# EAGLE design midi-in-out-mini (EAGLE 7.7.0)
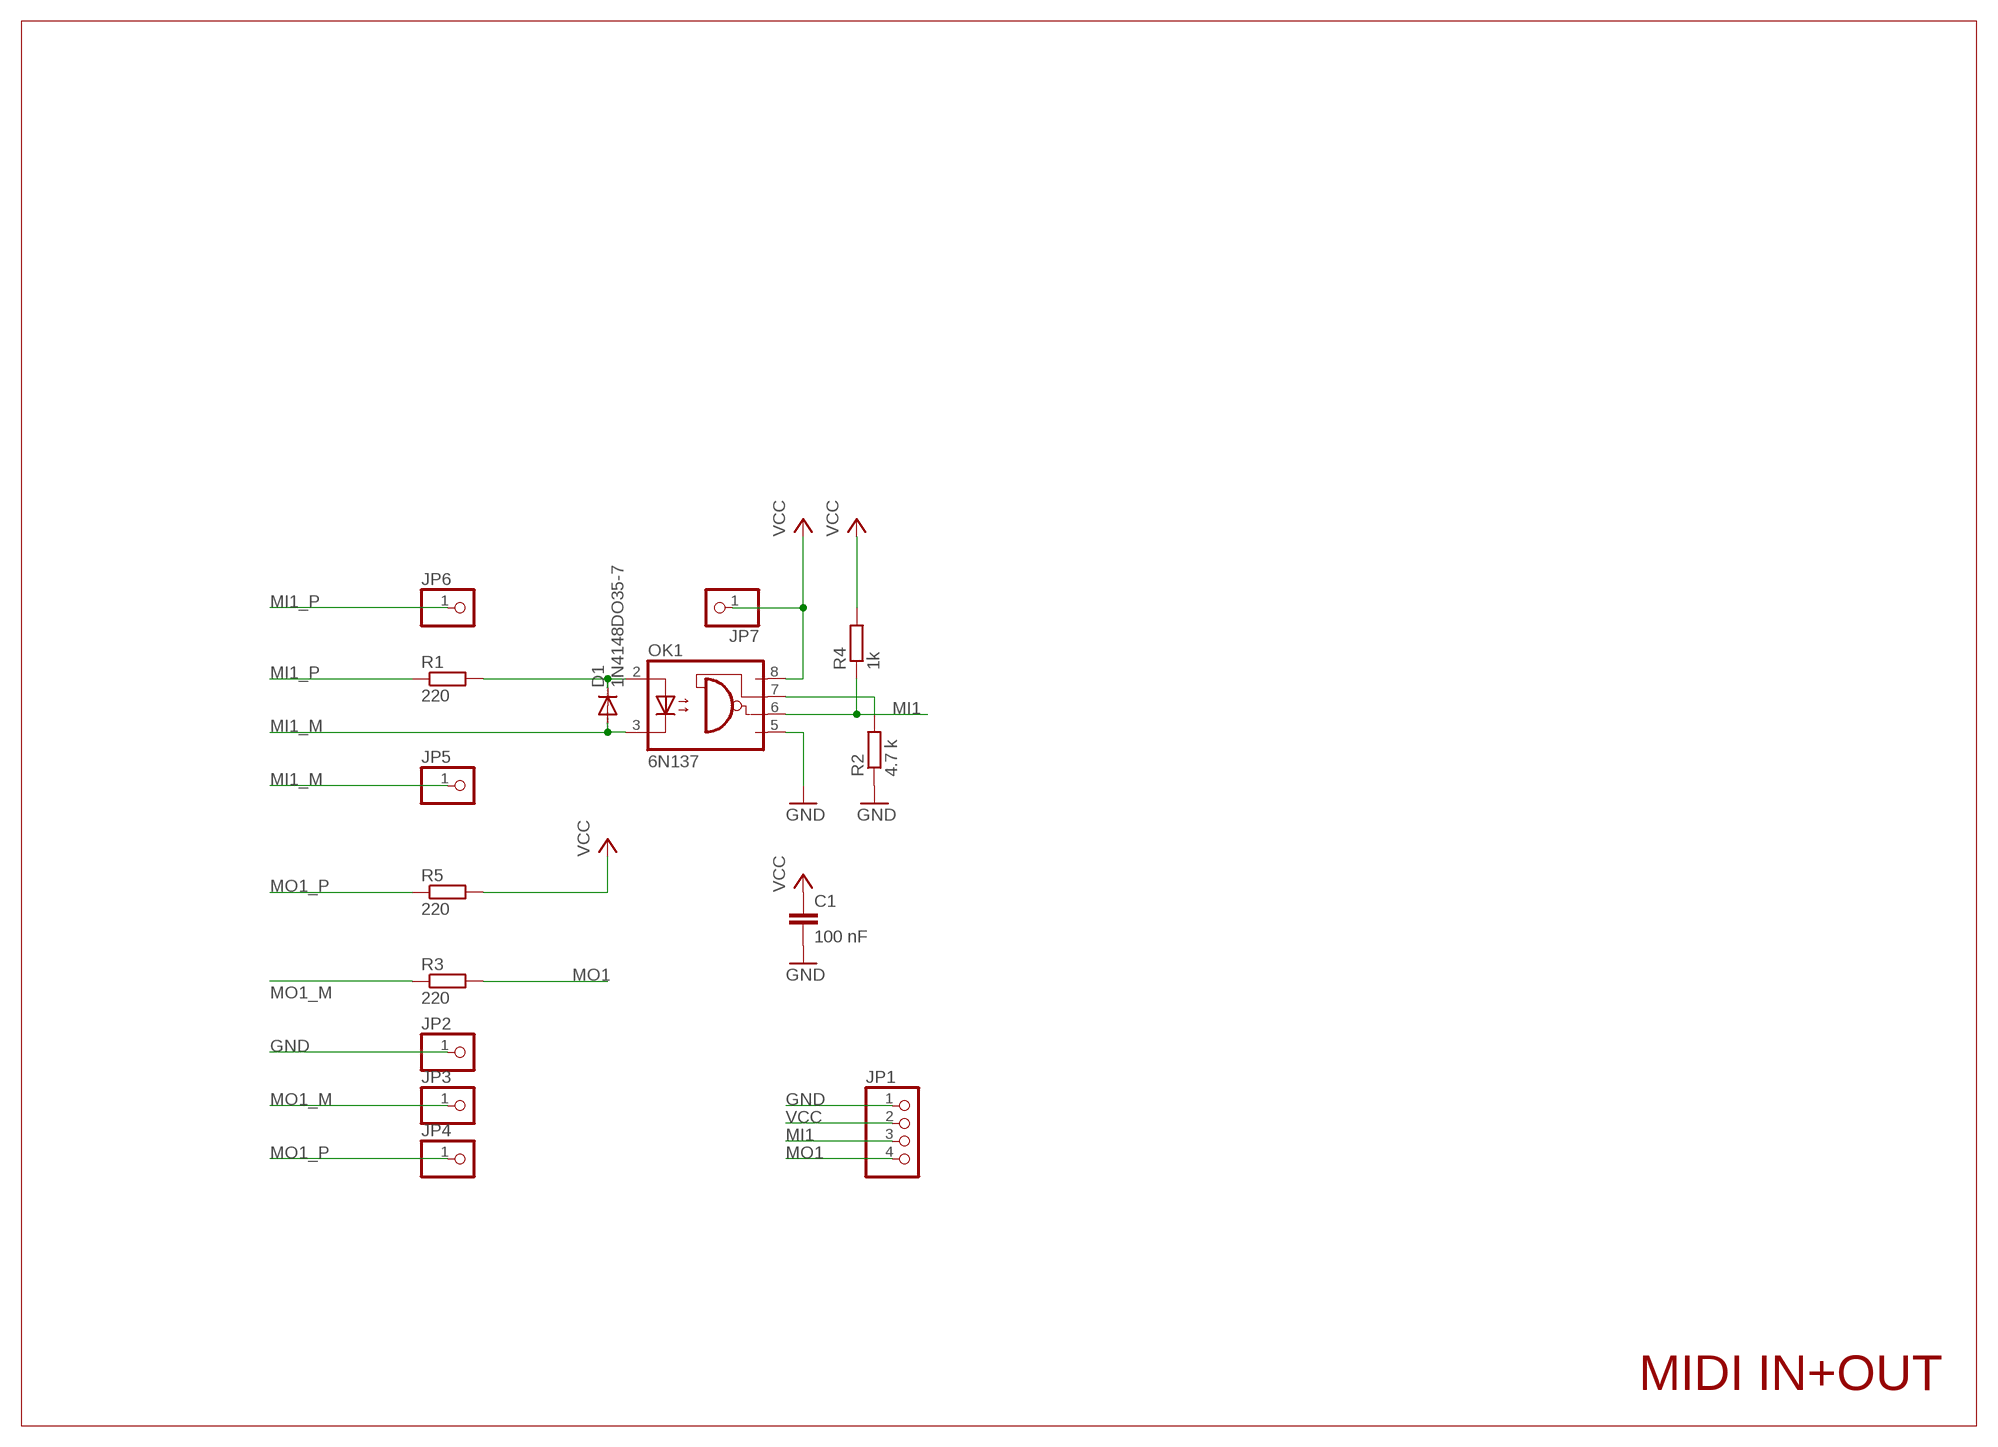
[diagram p0: schematic, sheet 1]

## Parts
C1  100 nF  C-EU025-024X044  [C025-024X044]
D1  1N4148DO35-7  [DO35-7]
JP1  PINHD-1X4/90  [1X04/90]
JP2  PINHD-1X1  [1X01]
JP3  PINHD-1X1  [1X01]
JP4  PINHD-1X1  [1X01]
JP5  PINHD-1X1  [1X01]
JP6  PINHD-1X1  [1X01]
JP7  PINHD-1X1  [1X01]
OK1  6N137  [DIL08]
R1  220  R-EU_0204/7  [0204/7]
R2  4.7 k  R-EU_0204/7  [0204/7]
R3  220  R-EU_0204/7  [0204/7]
R4  1k  R-EU_0204/7  [0204/7]
R5  220  R-EU_0204/7  [0204/7]

## Nets
GND: C1.2 JP1.1 JP2.1 OK1.5(GND) R2.1
MI1: JP1.3 OK1.6(VO) R4.1
MI1_M: D1.A JP5.1 OK1.3(C)
MI1_P: JP6.1 R1.1
MO1: JP1.4 R3.2
MO1_M: JP3.1 R3.1
MO1_P: JP4.1 R5.1
N$1: D1.C OK1.2(A) R1.2
N$3: OK1.7(VE) R2.2
VCC: C1.1 JP1.2 JP7.1 OK1.8(VCC) R4.2 R5.2

## Notes on the sheet
- MIDI IN+OUT

## Library data of the parts
C1 = rcl:C-EU: CAPACITOR, European symbol
D1 = diode:1N4148: DIODE high speed (Philips)
JP1 = pinhead:PINHD-1X4: PIN HEADER
JP2-JP7 = pinhead:PINHD-1X1: PIN HEADER
OK1 = optocoupler:6N137: MOTOROLA OPTO COUPLER; MPN: 6N137; OC_FARNELL: 1328376; OC_NEWARK: 52M1895
R1-R5 = rcl:R-EU_: RESISTOR, European symbol

## Board
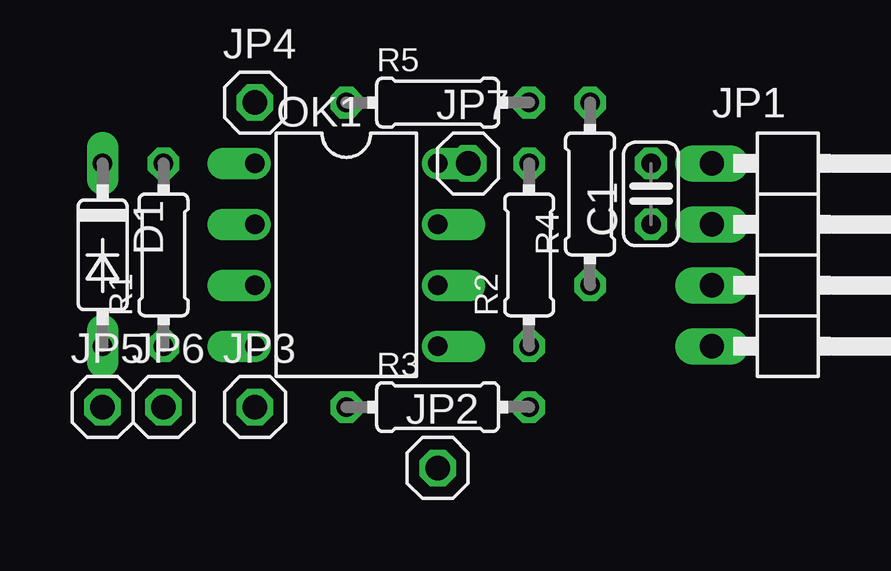
[diagram p1: board, top side]
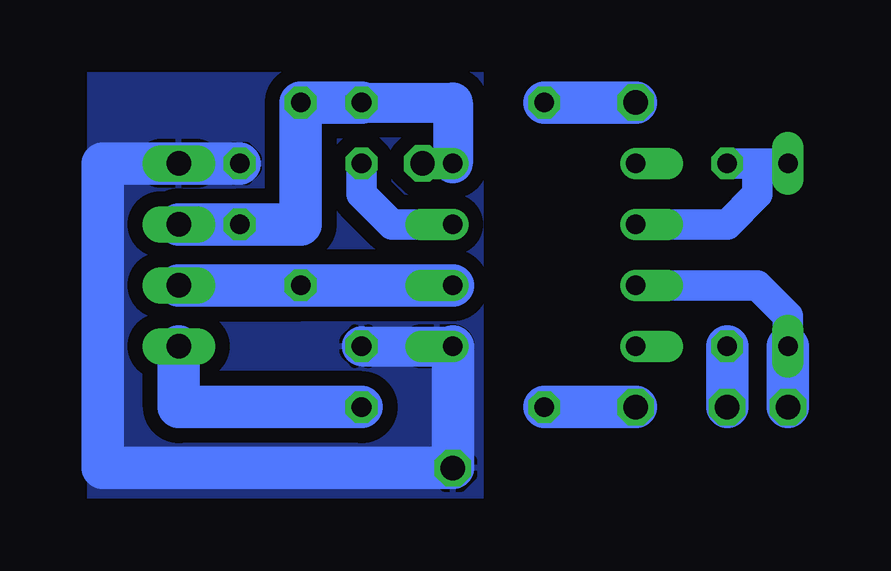
[diagram p2: board, bottom side, seen from below]

No outline drawn. Coordinates in mm, seen from the top.
Copper layers (1*16): Top 0.035mm / dielectric 1.5mm / Bottom 0.035mm
Design rules "default": minimum track width 10mil, minimum drill 24mil, track to track 8mil, track to pad 8mil, pad to pad 8mil, via to via 8mil, smd to smd 8mil, copper to edge 40mil, drill to drill 8mil, minimum pad ring 10mil, minimum via ring 8mil, stop-mask expansion 4mil, vias tented up to drill 0mil, thermal gap 10mil

### Footprints (pad centres in the part's own frame; a part is rotated, then mirrored left to right if it is on the bottom)
C025-024X044 = drill 0.813 octagon: 1 -1.27,0; 2 1.27,0
DO35-7 = drill 0.813 long: A 3.81,0; C -3.81,0
1X04/90 = drill 1.016 long: 1 -3.81,-3.81; 2 -1.27,-3.81; 3 1.27,-3.81; 4 3.81,-3.81
1X01 = drill 1.016 octagon: 1 0,0
DIL08 = drill 0.813 offset: 1 -3.81,-3.81; 2 -1.27,-3.81; 3 1.27,-3.81; 4 3.81,-3.81; 5 3.81,3.81; 6 1.27,3.81; 7 -1.27,3.81; 8 -3.81,3.81
0204/7 = drill 0.813 octagon: 1 -3.81,0; 2 3.81,0

### Placement (x,y rotation side)
C1  24.13,12.7 90 top
D1  1.27,10.16 270 top
JP1  30.48,10.16 270 top
JP2  15.24,1.27 0 top
JP3  7.62,3.81 0 top
JP4  7.62,16.51 0 top
JP5  1.27,3.81 0 top
JP6  3.81,3.81 0 top
JP7  16.51,13.97 0 top
OK1  11.43,10.16 270 top
R1  3.81,10.16 90 top
R2  19.05,10.16 90 top
R3  15.24,3.81 0 top
R4  21.59,12.7 90 top
R5  15.24,16.51 0 top

### Tracks (layer width: path | path; a pad name or v marks a point on that pad's centre or on a via)
GND
  Bottom 1.676: R2.1 OK1.5
  Bottom 1.778: C1.2 JP1.1 29.84,13.97 29.84,1.27 JP2.1 OK1.5
  pour Bottom (isolate 0.61): 13.97,0 30.48,0 30.48,17.78 13.97,17.78
MI1
  Bottom 1.778: OK1.6 R4.1 JP1.3
MI1_M
  Bottom 1.27: OK1.3 2.54,8.89 1.27,7.62 D1.A
  Bottom 1.778: JP5.1 D1.A
MI1_P
  Bottom 1.778: JP6.1 R1.1
MO1
  Bottom 1.778: R3.2 26.67,3.81 JP1.4
MO1_M
  Bottom 1.778: R3.1 JP3.1
MO1_P
  Bottom 1.778: R5.1 JP4.1
N$1
  Bottom 1.27: D1.C 2.54,13.97 | 2.54,13.97 R1.2 | OK1.2 3.81,11.43 2.54,12.7 2.54,13.97
N$3
  Bottom 1.27: OK1.7 17.78,11.43 19.05,12.7 R2.2
VCC
  Bottom 1.27: JP7.1 OK1.8
  Bottom 1.676: R5.2 15.24,16.51 OK1.8
  Bottom 1.778: R5.2 R4.2 21.59,11.43 C1.1 JP1.2